# Altium project TK532_Kondensatorkort.PrjPcb
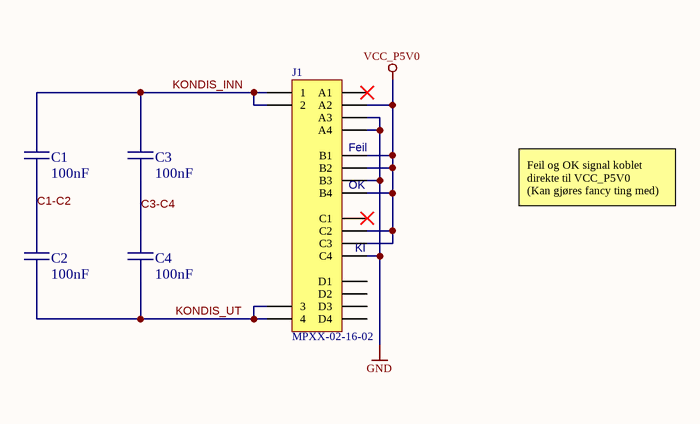
[diagram p0: TK532_Kondensatorkort.SchDoc]
1 sheet, 5 parts. Net scope: global (net labels, ports and power ports of the same name join across sheets).
Board file: TK532_Kondensatorkort.PcbDoc

## Sheet TK532_Kondensatorkort.SchDoc: TK532 Kondensatorkort
size A3; Author: Øystein Smith; Organization: Omega Verksted; Revision: 1.1

### Parts
C1  100nF  [CAPAR11L45]
C2  100nF  [CAPAR11L45]
C3  100nF  [CAPAR11L45]
C4  100nF  [CAPAR11L45]
J1  MPXX-02-16-02  [MPTC-02-16-02-01-03-L-RA-SD]

### Nets
GND: J1.7(A3) J1.8(A4) J1.11(B3) J1.16(C4)
VCC_P5V0: J1.6(A2) J1.9(B1) J1.10(B2) J1.12(B4) J1.14(C2) J1.15(C3)
C1-C2: C1.1 C2.2
C3-C4: C3.1 C4.2
KONDIS_INN: C1.2 C3.2 J1.1 J1.2
KONDIS_UT: C2.1 C4.1 J1.3 J1.4

Not connected (* = marked no-connect by the designer): J1 5(A1)* 13(C1)* 17(D1) 18(D2) 19(D3) 20(D4)

### Notes on the sheet
- (near J1) Feil
- (near J1) OK
- Feil og OK signal koblet direkte til VCC_P5V0
  (Kan gjøres fancy ting med)
- (near J1) KI
- Size:
- Date:
- Title:
- A3
- Revision:
- Sheet
- of
- Author:
- File:

### Library data of the parts
C1-C4 = 4153: 2kV(kanskje) polypropylene film capacitor, D22, L50; id: 4153; pakke_opprettet_av: 1154; symbol_opprettet_av: 815; leverandor_varenr: 2347676; pris: 10; nokkelord: capacitor, kondis, tesla; produsent: Cornell Dubilier; leverandor: Farnell; pakketype: TH; rad: 12; rom: OV; lager_type: Fremlager; dybde: 2; hylle: 4; antall: 25; pakke_opprettet: 19/08/2017 15:47:34; symbol_opprettet: 14/11/2014 20:19:34; navn: 100nF; komponenttype: 2
J1 = 3221: SAMTEC Connector; pakke_opprettet_av: 815; pris: 30; pakketype: TH; id: 3221; komponenttype: 11; leverandor: Mouser; nokkelord: Kan kjøpes rett fra SAMTEC; navn: MPTC-02-16-02-01-03-L-RA-SD; pakke_opprettet: 13/07/2014 16:35:56; symbol_opprettet_av: 815; symbol_opprettet: 13/07/2014 16:35:21; produsent: SAMTEC; leverandor_varenr: MPTC-02-16-02-01-03-L-RA-SD